# Altium project ST_LINK_ADAPTER_BOARD.PrjPcb
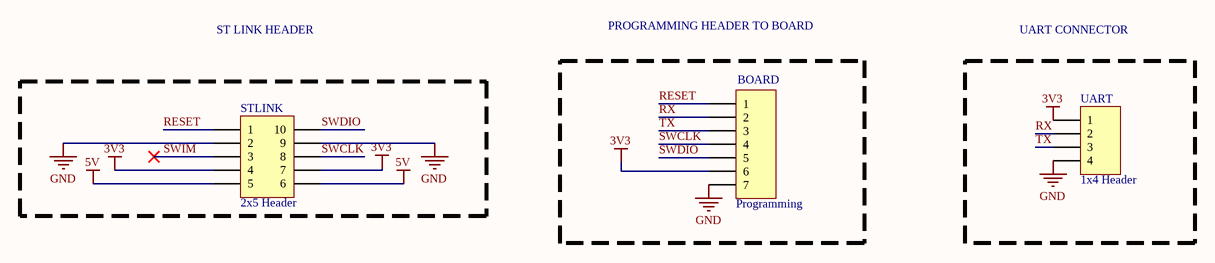
[diagram p0: Main.SchDoc]
1 sheet, 3 parts. Net scope: global (net labels, ports and power ports of the same name join across sheets).
Board file: Main.PcbDoc

## Sheet Main.SchDoc: ST LINK ADAPTER BOARD
size A4; Author: Dev Patel; Organization: Waterloop; Address1: 200 University Ave W; Address2: Engineering 5, 1104; Address3: Waterloo, ON; Address4: N2L 3G1; Revision: 1; SheetNumber: 1; SheetTotal: 1

### Parts
BOARD  Programming  [HDR1X7]
STLINK  2x5 Header  [HDR2x5]
UART  1x4 Header  [HDR1X4]

### Nets
3V3: BOARD.6 STLINK.4 STLINK.7 UART.1
5V: STLINK.5 STLINK.6
GND: BOARD.7 STLINK.2 STLINK.9 UART.4
RESET: BOARD.1 STLINK.1
RX: BOARD.2 UART.2
SWCLK: BOARD.4 STLINK.8
SWDIO: BOARD.5 STLINK.10
SWIM: STLINK.3
TX: BOARD.3 UART.3

### Notes on the sheet
- ST LINK HEADER
- PROGRAMMING HEADER TO BOARD
- UART CONNECTOR
- Title:
- Size:
- Date:
- A4
- Author:
- Revision:
- Sheet
- of
- File:

### Library data of the parts
BOARD = 1x7 Header: 1x7 Pin Header
STLINK = 2x5 Header: 2x5 Pin Header
UART = 1x4 Header: 1x4 Pin Header